# EAGLE design Interface V3 (EAGLE 9.6.2)
AUTHOR: Jordan Kochavi; BOARD_NAME: Interface Board; DOC_NUM: 1; PROJECT_NAME: CAN Interface Node; REVISION: 1
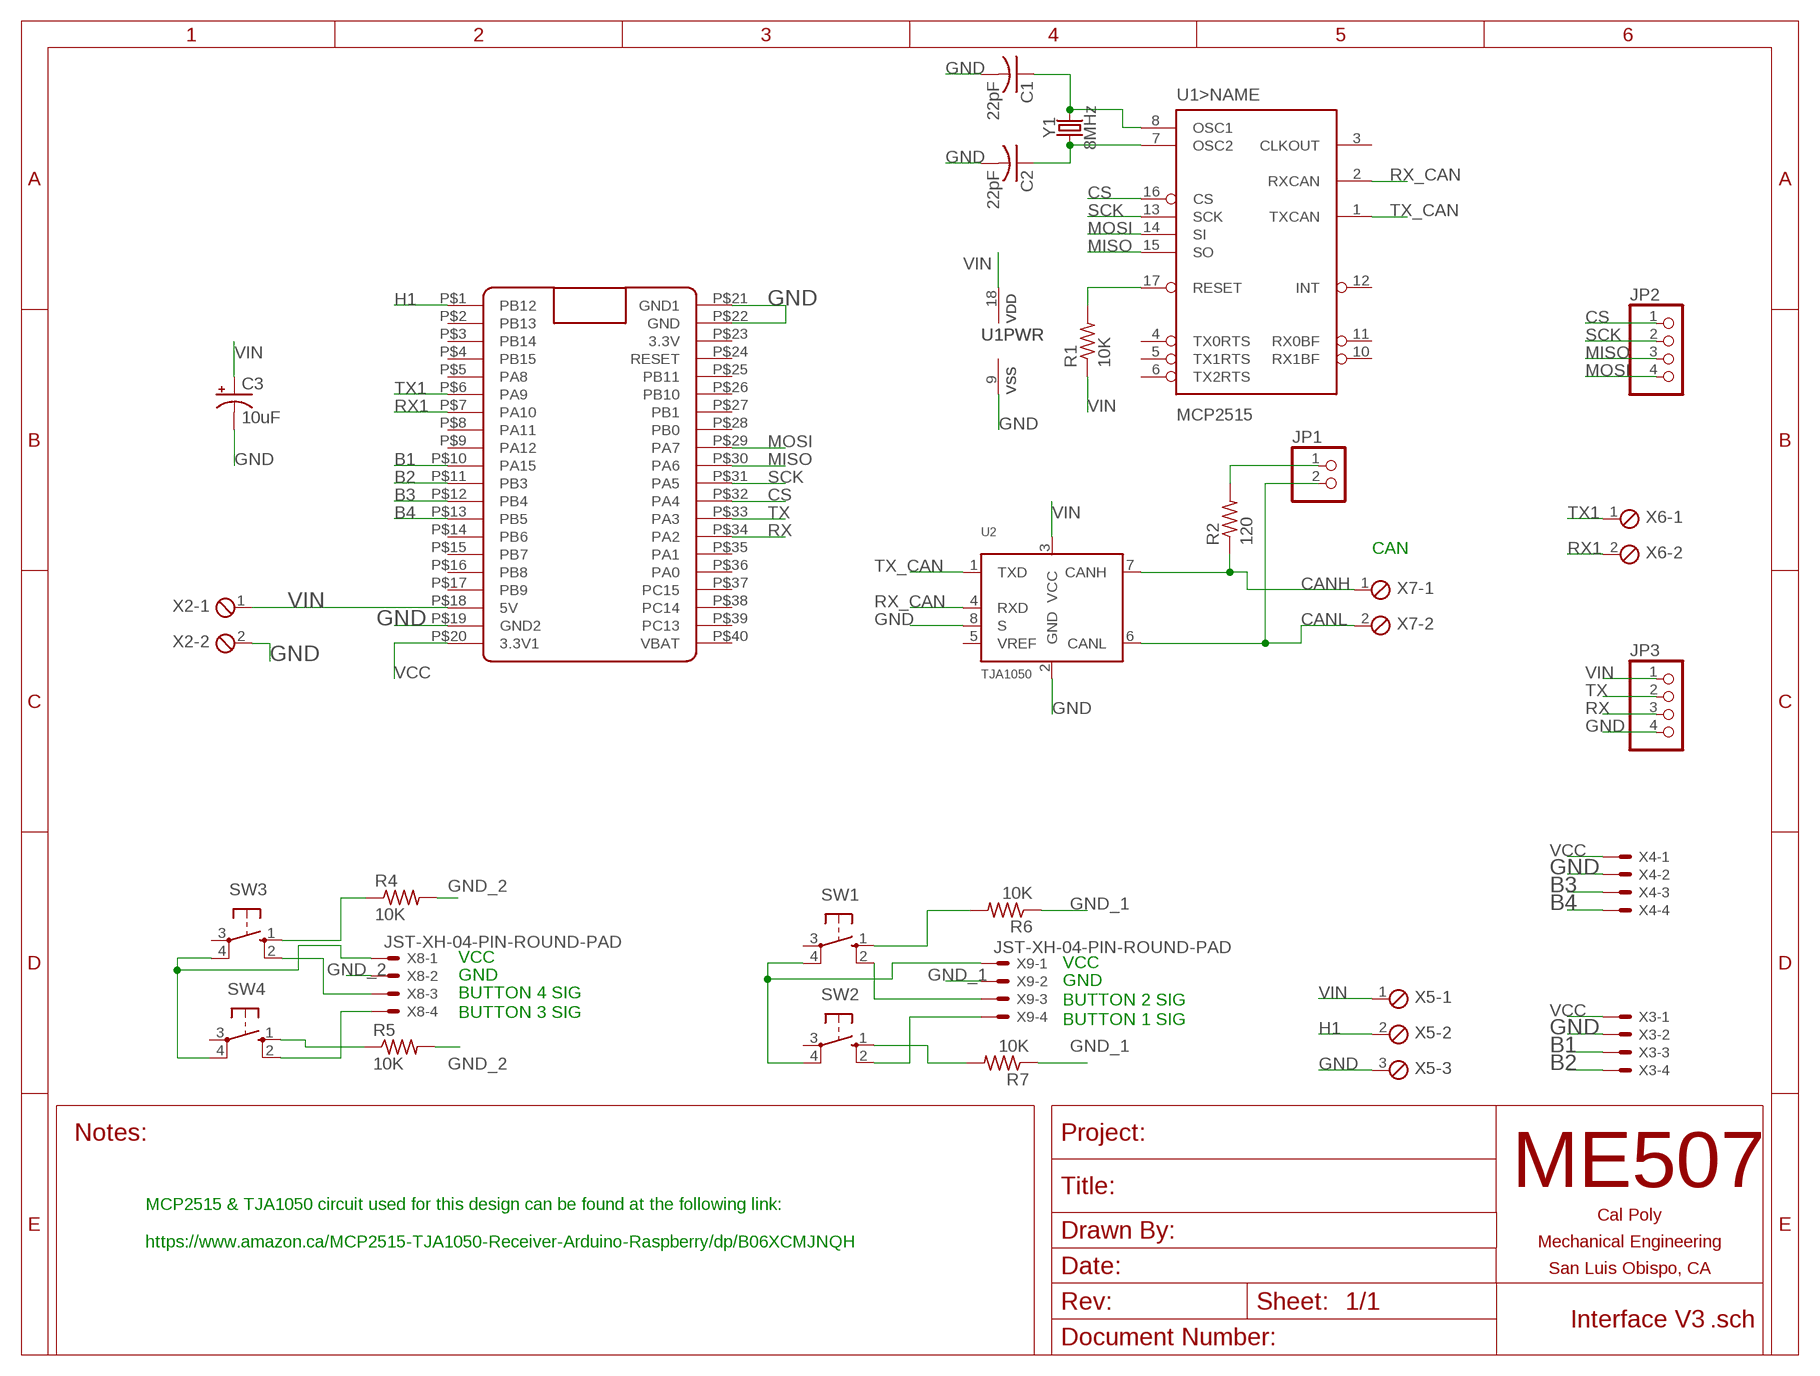
[diagram p0: schematic, sheet 1]

## Parts
C1  22pF  C-USC0805  [C0805]
C2  22pF  C-USC0805  [C0805]
C3  10uF  CPOL-USCT3216  [CT3216]
JP1  PINHD-1X2  [1X02]
JP2  PINHD-1X4  [1X04]
JP3  PINHD-1X4  [1X04]
R1  10K  R-US_R0805  [R0805]
R2  120  R-US_R0805  [R0805]
R4  10K  R-US_R0805  [R0805]
R5  10K  R-US_R0805  [R0805]
R6  10K  R-US_R0805  [R0805]
R7  10K  R-US_R0805  [R0805]
SW1  PUSHBUTTON  [B3F-10XX]
SW2  PUSHBUTTON  [B3F-10XX]
SW3  PUSHBUTTON  [B3F-10XX]
SW4  PUSHBUTTON  [B3F-10XX]
U1  MCP2515  MCP2515(MCP2510)SO  [SO18W]
U2  TJA1050  [SOT96-1]
U$1  BLUE_PILL  [BLUE_PILL]
X2  SCREWTERM_2P_381  [2POL381]
X3  JST-XH-04-PIN-LONG-PAD  [JST-XH-04-PACKAGE-LONG-PAD]
X4  JST-XH-04-PIN-LONG-PAD  [JST-XH-04-PACKAGE-LONG-PAD]
X5  SCREWTERM_3P_381  [3POL381]
X6  SCREWTERM_2P_381  [2POL381]
X7  SCREWTERM_2P_381  [2POL381]
X8  JST-XH-04-PIN-ROUND-PAD  [JST-XH-04-PACKAGE-ROUND-PAD]
X9  JST-XH-04-PIN-ROUND-PAD  [JST-XH-04-PACKAGE-ROUND-PAD]
Y1  8MHz  CRYSTALPTH-HC49US  [HC49US]

## Nets
B1: U$1.P$10(PA15) X3.3
B2: U$1.P$11(PB3) X3.4
B3: U$1.P$12(PB4) X4.3
B4: U$1.P$13(PB5) X4.4
CANH: R2.1 U2.7(CANH) X7.1
CANL: JP1.2 U2.6(CANL) X7.2
CS: JP2.1 U1.16(>NAME:CS) U$1.P$32(PA4)
GND: C1.2 C2.2 C3.- JP3.4 U1.9(PWR:VSS) U2.2(GND) U2.8(S) U$1.P$19(GND2) U$1.P$21(GND1) U$1.P$22(GND) X2.2 X3.2 X4.2 X5.3
GND_1: R6.1 R7.1 X9.2
GND_2: R4.2 R5.2 X8.2
H1: U$1.P$1(PB12) X5.2
MISO: JP2.3 U1.15(>NAME:SO) U$1.P$30(PA6)
MOSI: JP2.4 U1.14(>NAME:SI) U$1.P$29(PA7)
N$1: C2.1 U1.7(>NAME:OSC2) Y1.1
N$2: C1.1 U1.8(>NAME:OSC1) Y1.2
N$3: R1.2 U1.17(>NAME:RESET)
N$4: SW3.2(S1) X8.3
N$5: JP1.1 R2.2
N$6: SW4.2(S1) X8.4
N$7: R4.1 SW3.1(S)
N$8: R5.1 SW4.1(S)
N$9: SW3.4(P1) SW4.4(P1) X8.1
N$10: R6.2 SW1.1(S)
N$11: R7.2 SW2.1(S)
N$12: SW1.2(S1) X9.3
N$13: SW2.2(S1) X9.4
N$14: SW1.4(P1) SW2.4(P1) X9.1
RX: JP3.3 U$1.P$34(PA2)
RX1: U$1.P$7(PA10) X6.2
RX_CAN: U1.2(>NAME:RXCAN) U2.4(RXD)
SCK: JP2.2 U1.13(>NAME:SCK) U$1.P$31(PA5)
TX: JP3.2 U$1.P$33(PA3)
TX1: U$1.P$6(PA9) X6.1
TX_CAN: U1.1(>NAME:TXCAN) U2.1(TXD)
VCC: U$1.P$20(3.3V1) X3.1 X4.1
VIN: C3.+ JP3.1 R1.1 U1.18(PWR:VDD) U2.3(VCC) U$1.P$18(5V) X2.1 X5.1
Unconnected: SW1.3(P) SW2.3(P) SW3.3(P) SW4.3(P) U1.3(>NAME:CLKOUT) U1.4(>NAME:TX0RTS) U1.5(>NAME:TX1RTS) U1.6(>NAME:TX2RTS) U1.10(>NAME:RX1BF) U1.11(>NAME:RX0BF) U1.12(>NAME:INT) U2.5(VREF) U$1.P$2(PB13) U$1.P$3(PB14) U$1.P$4(PB15) U$1.P$5(PA8) U$1.P$8(PA11) U$1.P$9(PA12) U$1.P$14(PB6) U$1.P$15(PB7) U$1.P$16(PB8) U$1.P$17(PB9) U$1.P$23(3.3V) U$1.P$24(RESET) U$1.P$25(PB11) U$1.P$26(PB10) U$1.P$27(PB1) U$1.P$28(PB0) U$1.P$35(PA1) U$1.P$36(PA0) U$1.P$37(PC15) U$1.P$38(PC14) U$1.P$39(PC13) U$1.P$40(VBAT)

## Notes on the sheet
- CAN
- VCC
- VCC
- GND
- GND
- BUTTON 4 SIG
- BUTTON 2 SIG
- BUTTON 3 SIG
- BUTTON 1 SIG
- MCP2515 & TJA1050 circuit used for this design can be found at the following link: 
  
  https://www.amazon.ca/MCP2515-TJA1050-Receiver-Arduino-Raspberry/dp/B06XCMJNQH

## Library data of the parts
C1 C2 = rcl:C-US: CAPACITOR, American symbol; SPICEPREFIX: C
C3 = rcl:CPOL-US: POLARIZED CAPACITOR, American symbol; SPICEPREFIX: C
JP1 = pinhead:PINHD-1X2: PIN HEADER
JP2 JP3 = pinhead:PINHD-1X4: PIN HEADER
R1 R2 R4-R7 = rcl:R-US_: RESISTOR, American symbol; SPICEPREFIX: R
SW1-SW4 = ME507:PUSHBUTTON: OMRON SWITCH; MPN: B3F-1000; OC_FARNELL: 176432; OC_NEWARK: 36M3542
U1 = EDITED_SparkFun_IC_Comms:MCP2515(MCP2510): CAN controller with SPI interface The MCP2515 controller supercedes the MCP2510 while addressing all errata associated with it. The two devices are pin compatible, either can be used with this device. 18-pin package SOIC Simple SPI interface to any MCU. One-shot mode ensures message transmission is attempted only once Databyte filtering Start-of-Frame (SOF) output Low-power CMOS Technology Datasheet <http://www.sparkfun.com/datasheets/DevTools/Arduino/MCP2515.pdf> SparkFun Products CAN-BUS Shield <https://www.sparkfun.com/products/13262> (DEV-13262); PROD_ID: IC-09906
U2 = TJA1050:TJA1050: High speed CAN transceiver The TJA1050 is the interface between the Controller Area Network (CAN) protocol controller and the physical bus. The device provides differential transmit capability to the bus and differential receive capability to the CAN controller. The TJA1050 is the third Philips high-speed CAN transceiver after the PCA82C250 and the PCA82C251. The most important differences are: Much lower electromagnetic emission due to optimal matching of the output signals CANH and CANL Improved behaviour in case of an unpowered node No standby mode. This makes the TJA1050 eminently suitable for use in nodes that are in a power-down situation in partially powered networks. AAL Eindhoven MK; AVAILABILITY: Unavailable; DESCRIPTION: 1/1 Transceiver Half CANbus 8-SO; MF: NXP USA; MP: TJA1050; PACKAGE: SOIC-8 NXP USA; PRICE: None
U$1 = BluePill:BLUE_PILL
X2 X6 X7 = ME507_OCT_1:SCREWTERM_2P: Screw Terminal Block This part is designed for a screw terminal connector. The 2.54mm (0.100 inch) foorprint can also be used for male or female pin headers such as those on most development boards. One can also solder wires directly into the holes, though this makes modifications or repairs to the system more inconvenient. Larger versions can carry more current.
X3 X4 X8 X9 = Rembrandt Electronics - JST XH Connectors v1-0:JST-XH-04-PIN: JST XH Connector 2 Pin Wire to board connector. Pitch: 2,54 mm, (0.100") Number of pins: 4 Created by Rembrandt Electronics www.rembrandtelectronics.com
X5 = ME507_OCT_1:SCREWTERM_3P: Screw Terminal Block This part is designed for a screw terminal connector. The 2.54mm (0.100 inch) foorprint can also be used for male or female pin headers such as those on most development boards. One can also solder wires directly into the holes, though this makes modifications or repairs to the system more inconvenient. Larger versions can carry more current.
Y1 = SparkFun-Clocks:CRYSTAL: Crystals (Generic) These are passive quartz crystals, which can be used as a clock source for a microcontroller. Crystal's are two-terminal devices. They require external "load" capacitors to generate an oscillating signal.

## Board
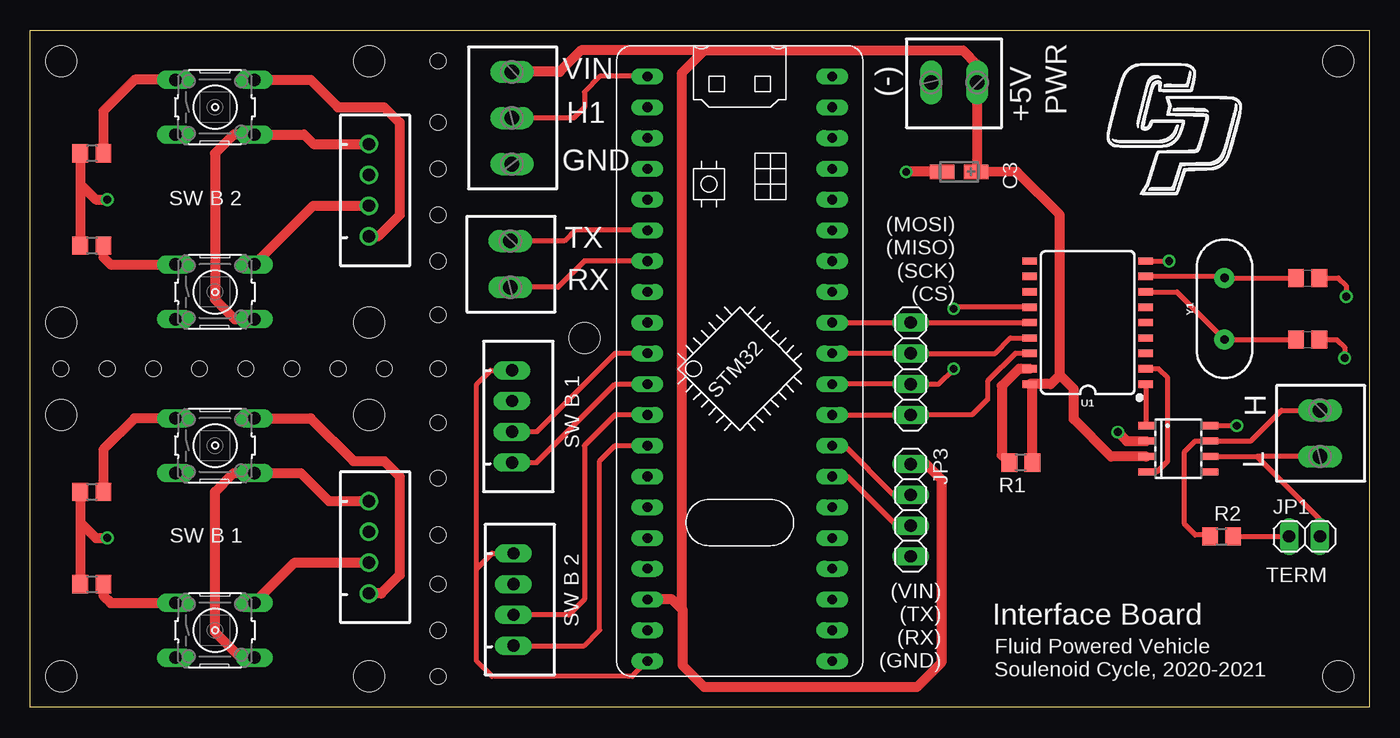
[diagram p1: board, top side]
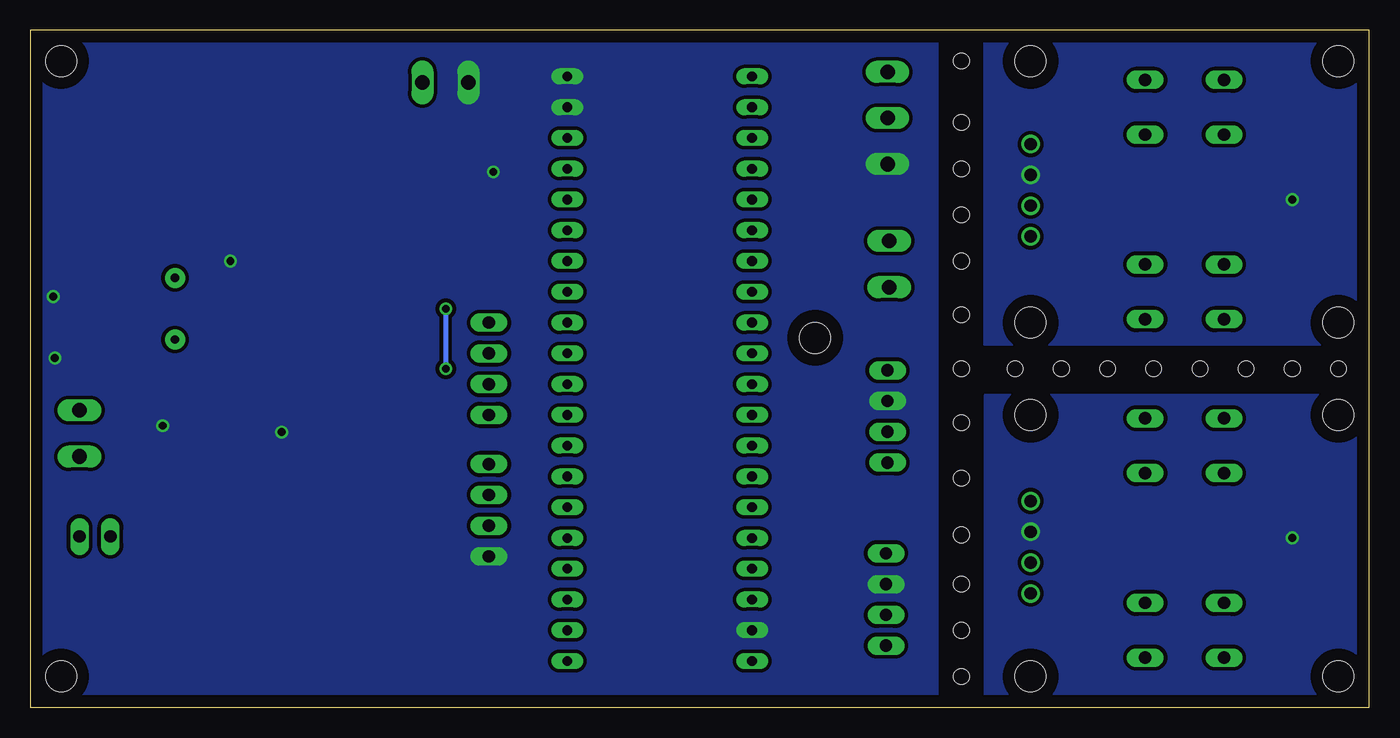
[diagram p2: board, bottom side, seen from below]

Size 110.49 x 55.88 mm. Coordinates in mm from the lower left corner, seen from the top.
Outline: 0,0 0,55.88 110.49,55.88 110.49,0 0,0
Copper layers (1*16): Top 0.035mm / dielectric 1.5mm / Bottom 0.035mm
Design rules "default": minimum track width 6mil, minimum drill 0.35mm, track to track 6mil, track to pad 6mil, pad to pad 6mil, via to via 6mil, smd to smd 6mil, copper to edge 40mil, drill to drill 6mil, minimum pad ring 10mil, minimum via ring 8mil, stop-mask expansion 4mil, vias tented up to drill 0mil, thermal gap 10mil
Holes 2.54 mm at 45.72,30.48 107.95,53.34 107.95,2.54 2.54,2.54 27.94,2.54 2.54,24.13 27.94,24.13 27.94,31.75 27.94,53.34 2.54,53.34 2.54,31.75
Holes 1.27 mm at 2.54,27.94 6.35,27.94 10.16,27.94 13.97,27.94 17.78,27.94 21.59,27.94 25.4,27.94 29.21,27.94 33.66,27.94 33.66,23.5 33.66,18.92 33.66,14.22 33.66,10.16 33.66,6.35 33.66,2.54 33.66,32.38 33.66,36.83 33.66,40.64 33.66,44.45 33.66,48.26 33.66,53.34

### Footprints (pad centres in the part's own frame; a part is rotated, then mirrored left to right if it is on the bottom)
C0805 = smd 1.3 x 1.5: 1 -0.95,0; 2 0.95,0
CT3216 = smd 2 x 1.2: + -1.4,0; - 1.4,0
1X02 = drill 1.016 long: 1 -1.27,0; 2 1.27,0
1X04 = drill 1.016 long: 1 -3.81,0; 2 -1.27,0; 3 1.27,0; 4 3.81,0
R0805 = smd 1.3 x 1.5: 1 -0.95,0; 2 0.95,0
B3F-10XX = drill 1.016 long: 1 -3.251,2.261; 2 3.251,2.261; 3 -3.251,-2.261; 4 3.251,-2.261
SO18W = smd 0.6 x 1.2: 1 -5.08,-4.788; 2 -3.81,-4.788; 3 -2.54,-4.788; 4 -1.27,-4.788; 5 0,-4.788; 6 1.27,-4.788; 7 2.54,-4.788; 8 3.81,-4.788; 9 5.08,-4.788; 10 5.08,4.788; 11 3.81,4.788; 12 2.54,4.788; 13 1.27,4.788; 14 0,4.788; 15 -1.27,4.788; 16 -2.54,4.788; 17 -3.81,4.788; 18 -5.08,4.788
SOT96-1 = smd 0.6 x 1.3: 1 -1.905,-2.65; 2 -0.635,-2.65; 3 0.635,-2.65; 4 1.905,-2.65; 5 1.905,2.65; 6 0.635,2.65; 7 -0.635,2.65; 8 -1.905,2.65
BLUE_PILL = drill 0.8 long: P$1 -7.62,15.24; P$2 -7.62,12.7; P$3 -7.62,10.16; P$4 -7.62,7.62; P$5 -7.62,5.08; P$6 -7.62,2.54; P$7 -7.62,0; P$8 -7.62,-2.54; P$9 -7.62,-5.08; P$10 -7.62,-7.62; P$11 -7.62,-10.16; P$12 -7.62,-12.7; P$13 -7.62,-15.24; P$14 -7.62,-17.78; P$15 -7.62,-20.32; P$16 -7.62,-22.86; P$17 -7.62,-25.4; P$18 -7.62,-27.94; P$19 -7.62,-30.48; P$20 -7.62,-33.02; P$21 7.62,15.24; P$22 7.62,12.7; P$23 7.62,10.16; P$24 7.62,7.62; P$25 7.62,5.08; P$26 7.62,2.54; P$27 7.62,0; P$28 7.62,-2.54; P$29 7.62,-5.08; P$30 7.62,-7.62; P$31 7.62,-10.16; P$32 7.62,-12.7; P$33 7.62,-15.24; P$34 7.62,-17.78; P$35 7.62,-20.32; P$36 7.62,-22.86; P$37 7.62,-25.4; P$38 7.62,-27.94; P$39 7.62,-30.48; P$40 7.62,-33.02
2POL381 = drill 1.2 long: 1 -1.905,0; 2 1.905,0
JST-XH-04-PACKAGE-LONG-PAD = drill 1.016 long: 1 -3.81,0; 2 -1.27,0; 3 1.27,0; 4 3.81,0
3POL381 = drill 1.2 long: 1 -3.81,0; 2 0,0; 3 3.81,0
JST-XH-04-PACKAGE-ROUND-PAD = drill 1.016: 1 -3.81,0; 2 -1.27,0; 3 1.27,0; 4 3.81,0
HC49US = drill 0.7 pad 1.651: 1 -2.54,0; 2 2.54,0

### Placement (x,y rotation side)
C1  105.41,35.43 0 top
C2  105.41,30.35 0 top
C3  76.66,44.2 180 top
JP1  105.16,14.1 0 top
JP2  72.64,27.94 90 top
JP3  72.64,16.26 270 top
R1  81.74,20.19 180 top
R2  98.3,14.1 0 top
R4  5.08,38.1 180 top
R5  5.08,45.72 180 top
R6  5.08,10.16 0 top
R7  5.08,17.78 0 top
SW1  15.24,6.35 0 top
SW2  15.24,21.59 0 top
SW3  15.24,34.29 0 top
SW4  15.24,49.53 0 top
U1  87.25,31.75 90 top
U2  94.74,21.34 270 top
U$1  58.55,36.83 0 top
X2  76.23,51.56 180 top
X3  39.75,24 270 top
X4  39.88,8.89 270 top
X5  39.75,48.64 270 top
X6  39.62,36.58 270 top
X7  106.43,22.61 270 top
X8  27.94,42.67 270 top
X9  27.94,13.21 270 top
Y1  98.55,32.89 90 top

### Tracks (layer width: path | path; a pad name or v marks a point on that pad's centre or on a via)
B1
  Top 0.406: U$1.P$10 48.26,29.21 41.78,22.73 X3.3
B2
  Top 0.406: X3.4 41.78,20.19 48.26,26.67 U$1.P$11
B3
  Top 0.406: U$1.P$12 48.26,24.13 45.72,21.59 45.72,8.89 44.45,7.62 X4.3
B4
  Top 0.406: X4.4 45.72,5.08 46.99,6.35 46.99,20.32 48.26,21.59 U$1.P$13
CANH
  Top 0.406: R2.1 97.22,14.22 96.14,14.22 95.25,15.11 95.25,21.08 96.14,21.97 U2.7 100.71,21.97 103.25,24.51 X7.1
CANL
  Top 0.406: JP1.2 106.43,15.49 101.22,20.7 | U2.6 101.22,20.7 | X7.2 101.22,20.7
CS
  Top 0.406: U$1.P$32 JP2.1 77.72,24.13 78.99,25.4 78.99,26.92 81.28,29.21 U1.16
GND  (via drill 0.65)
  Top 0.406: U2.8 v99.57,23.24 | U1.9 v93.98,36.83 | C2.2 107.82,30.35 108.46,29.72 v108.46,28.83 | C1.2 107.95,35.43 108.58,34.8 v108.58,33.91
  Top 0.813: 90.48,21.97 U2.2 | C3.- 75.25,44.2 v72.28,44.2 | v89.75,22.71 90.48,21.97 | 90.48,21.97
  pour Bottom (isolate 0.305, no thermals): 36.83,-2.54 36.83,58.42 115.57,58.42 115.57,-2.54
  pour Bottom (isolate 0.305, no thermals): 35.56,-5.08 35.56,58.42 115.57,58.42 115.57,-5.08
GND_1  (via drill 0.65)
  Top 0.813: R7.1 4.13,15.24 | 4.13,15.24 R6.1 | 4.13,15.24 5.4,13.97 v6.35,13.97
  pour Bottom (isolate 0.305, no thermals): 0,0 0,25.77 31.75,25.77 31.75,0
GND_2  (via drill 0.65)
  Top 0.813: R5.2 4.13,43.18 | 4.13,43.18 R4.2 | 4.13,43.18 5.4,41.91 v6.35,41.91
  pour Bottom (isolate 0.305, no thermals): 0,29.9 31.75,29.9 31.75,55.88 0,55.88
  pour Bottom (isolate 0.305, no thermals): 0,30.12 31.75,30.12 31.75,55.88 0,55.88
H1
  Top 0.406: U$1.P$1 46.99,52.07 45.72,50.8 45.72,49.53 44.83,48.64 X5.2
MISO
  Top 0.406: U$1.P$30 JP2.3 79.63,29.21 80.9,30.48 U1.15
MOSI
  Top 0.406: U$1.P$29 JP2.4 U1.14
N$1
  Top 0.406: U1.7 94.61,34.29 Y1.1 C2.1
N$2
  Top 0.406: U1.8 98.42,35.56 Y1.2 C1.1
N$3
  Top 0.813: U1.17 81.6,27.94 80.18,26.52 80.18,20.82 R1.2
N$4
  Top 0.813: SW3.2 23.34,41.4 X8.3
N$5
  Top 0.406: R2.2 JP1.1
N$6
  Top 0.813: SW4.2 23.14,51.79 25.4,49.53 29.21,49.53 30.48,48.26 30.48,40.64 28.7,38.86 X8.4
N$7
  Top 0.813: R4.1 6.03,37.15 6.63,36.55 SW3.1
N$8
  Top 0.813: SW4.1 8.61,51.79 6.03,49.21 R5.1
N$9
  Top 0.813: SW3.4 16.87,32.03 15.24,33.66 15.24,45.72 16.79,47.27 SW4.4 22.58,47.27 23.37,46.48 X8.1
N$10
  Top 0.813: R6.2 6.03,9.21 6.63,8.61 SW1.1
N$11
  Top 0.813: SW2.1 8.61,23.85 6.03,21.27 R7.2
N$12
  Top 0.813: SW1.2 21.82,11.94 X9.3
N$13
  Top 0.813: SW2.2 23.14,23.85 26.67,20.32 29.21,20.32 30.48,19.05 30.48,10.92 28.96,9.4 X9.4
N$14
  Top 0.813: SW1.4 17.35,4.09 15.24,6.2 15.24,17.78 16.79,19.33 SW2.4 22.33,19.33 24.64,17.02 X9.1
RX
  Top 0.406: JP3.3 71.5,14.99 67.44,19.05 U$1.P$34
RX1
  Top 0.406: U$1.P$7 45.72,36.83 43.56,34.67 X6.2
RX_CAN
  Top 0.406: U2.4 92.96,19.43 93.85,20.32 93.85,27.18 93.09,27.94 U1.2
SCK  (via drill 0.65)
  Top 0.406: U$1.P$31 JP2.2 74.93,26.67 v76.2,27.94 | U1.13 76.33,33.02 v76.2,32.89
  Bottom 0.406: v76.2,32.89 v76.2,27.94
TX
  Top 0.406: JP3.2 71.25,17.53 67.18,21.59 U$1.P$33
TX1
  Top 0.406: U$1.P$6 44.96,39.37 44.07,38.48 X6.1
TX_CAN
  Top 0.406: U1.1 92.04,23.3 U2.1
VCC
  Top 0.406: U$1.P$20 49.66,2.54 38.1,2.54 36.83,3.81 36.83,11.43 | 36.83,11.43 38.1,12.7 X4.1 | 36.83,11.43 36.83,26.67 37.97,27.81 X3.1
VIN
  Top 0.813: 84.96,27.43 84.2,26.67 U1.18 82.69,26.44 R1.1 | JP3.1 73.91,20.07 75.18,18.8 75.18,3.68 73.15,1.65 55.64,1.65 53.85,3.44 53.85,8 53.78,8.06 | 53.78,8.06 52.96,8.89 U$1.P$18 | 53.78,8.06 53.78,52.39 55.63,54.23 | 55.63,54.23 76.96,54.23 78.14,53.06 X2.1 78.14,44.26 C3.+ 81.42,44.19 84.96,40.65 84.96,27.43 | 55.63,54.23 45.47,54.23 43.69,52.45 X5.1 | U2.3 89.18,20.7 86.11,23.77 86.11,26.29 84.96,27.43

### Text on the board
tNames: (-) | +5V | VIN | PWR | H1 | GND | SW B 2 | (MOSI) / (MISO) / (SCK) / (CS) | TX | RX | H | SW B 1 | L | SW B 1 | TERM | (VIN) / (TX) / (RX) / (GND) | SW B 2 | Interface Board | Fluid Powered Vehicle / Soulenoid Cycle, 2020-2021